# EasyEDA Pro project new0.2.epro, board PCB1_1
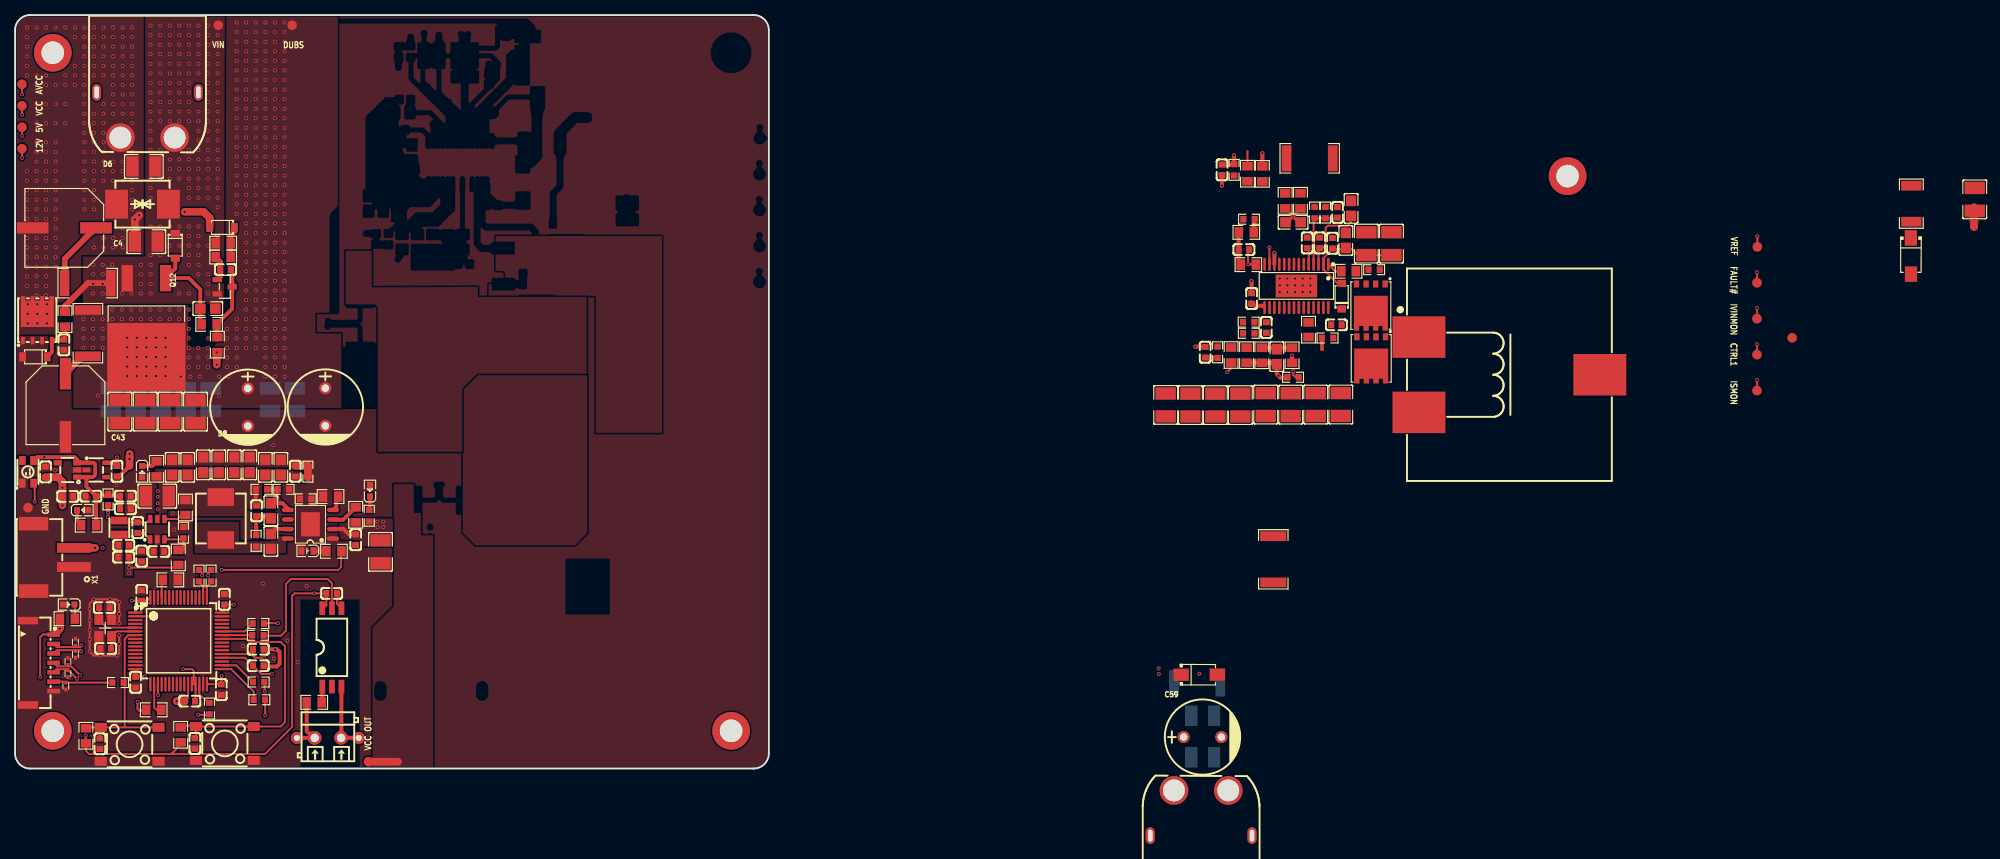
[diagram p1: board, top side]
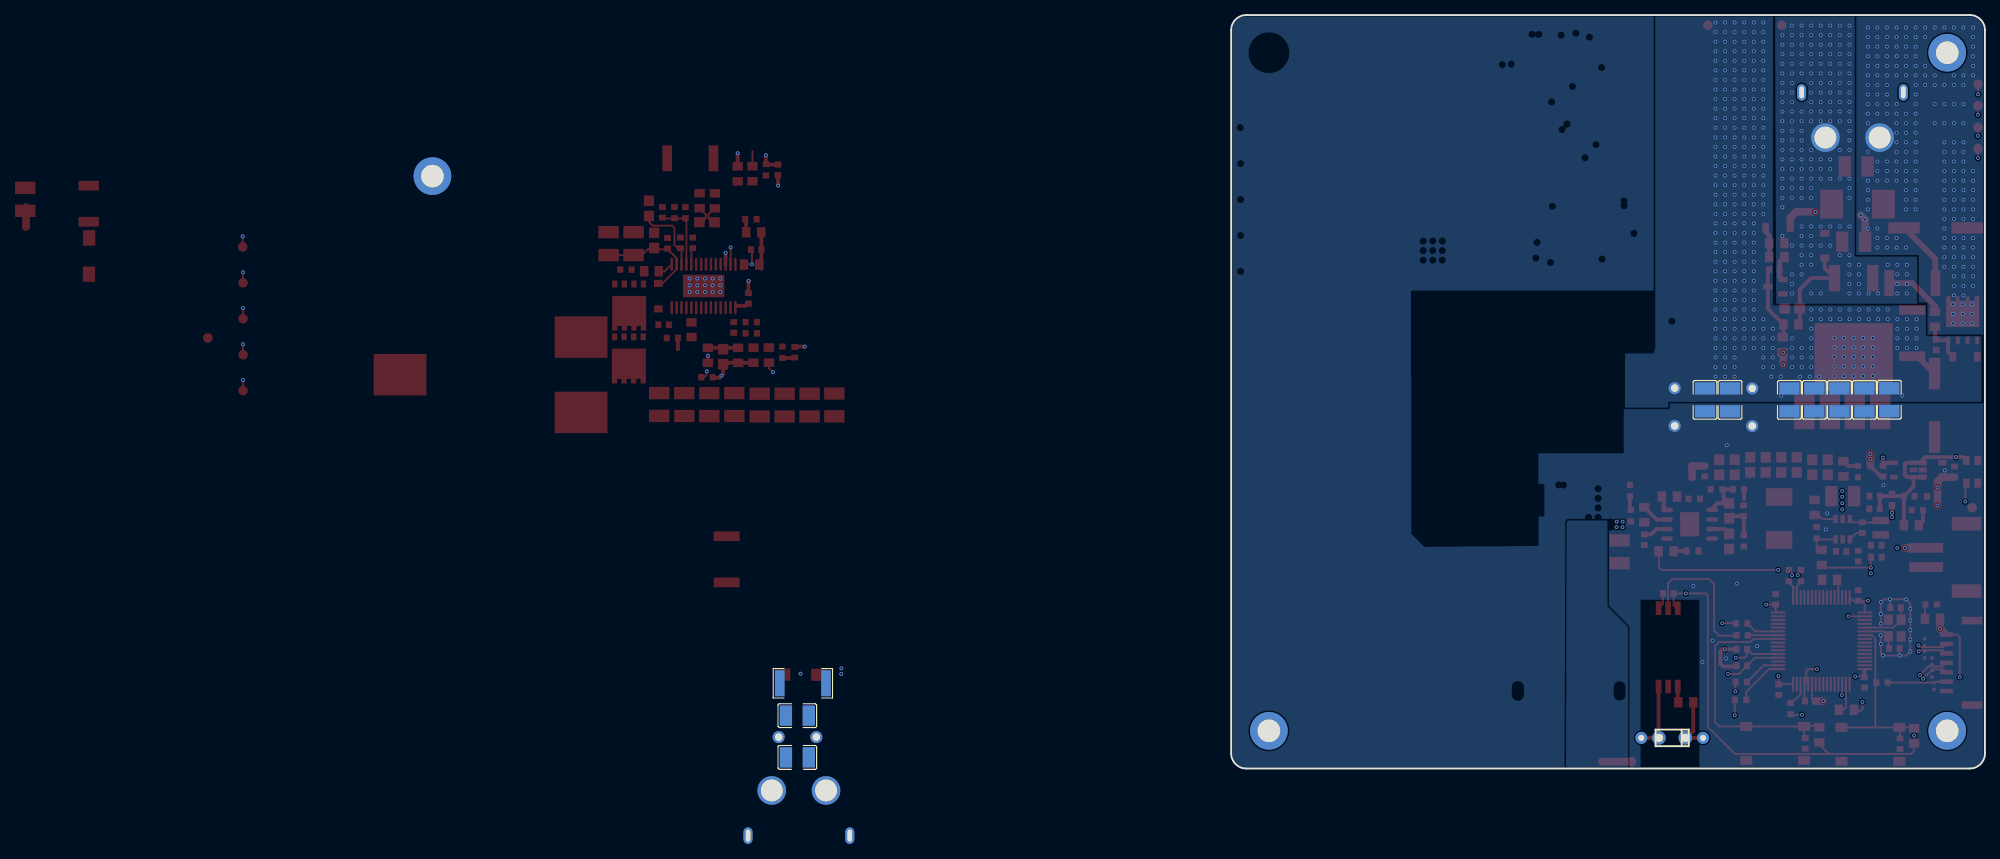
[diagram p2: board, bottom side, seen from below]

Outline 100 x 100 mm; copper layers: Top Layer, Inner1, Inner2, Inner3, Inner4, Bottom Layer. Coordinates in mm from the lower left corner of the outline.
Outline path: 0,98 0,2 arc(0.59,0.59) 2,0 98,0 arc(99.41,0.59) 100,2 100,98 arc(99.41,99.41) 98,100 2,100 arc(0.59,99.41) 0,98
Stack: Top Layer 0.035mm Outer layer thickness 1oz / Dielectric1 0.0994mm 3313 RC57% 4.2mil / Inner1 0.0152mm Inner layer thickness / Dielectric2 0.55mm 0.55mm H/H No copper / Inner2 0.0152mm Inner layer thickness / Dielectric3 0.1088mm 2116 RC54% 4.9mil / Inner3 0.0152mm Inner layer thickness / Dielectric4 0.55mm 0.55mm H/H No copper / Inner4 0.0152mm Inner layer thickness / Dielectric5 0.0994mm 3313 RC57% 4.2mil / Bottom Layer 0.035mm Outer layer thickness 1oz

## Design rules (mm)
net $1N984: DP6
net VCC_OUT: DP6
net $1N732: DP2
net $1N731: DP2
net $1N734: DP1
net $1N733: DP1
net $1N979: DP5
net $1N980: DP5
net DCBUS: DP7
net $1N947: DP7
net CLK: DP8
net DIO: DP8
spacing safeClearance (default): track to track 0.127, other pairs 0.127 to 0.127
spacing Copper_copperRegion: track to track 0.152, other pairs 0.152 to 0.152
spacing Plane_innerPlane: track to track 0.152, other pairs 0.152 to 0.152
track width trackWidth (default): min 0.127, default 0.254, max 2.54
differential pair differentialPair (default): width min 0.127, default 0.254, max 2.54; gap min 0.127, default 0.127
net GND uses copperRegion
net DCBUS uses copperRegion
net AGND uses copperRegion
net $1N947 uses copperRegion
net $1N990 uses copperRegion
net $1N984 uses copperRegion
net VCC_OUT uses copperRegion
net VCC_BAT uses copperRegion
net GND_BAT uses copperRegion
net 5V uses default
['net', '5v'] ['NET', '12V'] uses Copper_copperRegion

## Placement (name value [footprint] x y rotation side)
C1  1uF  [C0603]  10.05 36.15 180 top
C2  2.2uF  [C0603]  171.43 69.76 90 top
C3  10uF  [C1210]  17.08 79.91 0 top
C4  10uF  [C1210]  17.41 69.93 0 top
C5  100uF  [CAP-SMD_BD10.0-L10.3-W10.3-LS11.0-FD_1]  6.53 71.76 180 top
C6  100nF  [C0603]  6.47 56.23 90 top
C7  100nF  [C0603]  27.93 66.22 180 top
C8  1nF  [C0805]  25.57 61.04 0 top
C9  100uF  [CAP-SMD_BD10.0-L10.3-W10.3-LS11.0-FD_1]  6.68 48.21 270 top
C10  10uF  [C1210]  37.13 48.93 90 bottom
C11  10uF  [C1210]  33.82 48.93 90 bottom
C12  10uF  [C1210]  25.94 48.93 90 bottom
C13  10uF  [C1210]  22.63 48.93 90 bottom
C14  10uF  [C1210]  19.3 48.93 90 bottom
C15  10uF  [C1210]  15.99 48.93 90 bottom
C16  10uF  [C1210]  12.69 48.95 90 bottom
C17  220uF  [CAP-TH_BD10.0-P5.00-D0.6-FD_2]  30.88 47.95 270 top
C18  220uF  [CAP-TH_BD10.0-P5.00-D0.6-FD_2]  41.16 47.98 270 top
C19  10uF  [C1210]  20.58 47.37 90 top
C20  10uF  [C1210]  17.27 47.37 90 top
C21  2.2nF  [C0805]  33.94 30.14 90 top
C22  3.3nF  [C0603]  32.03 34.21 90 top
C23  10uF  [C1210]  48.48 28.76 270 top
C24  100nF  [C0603]  45.19 30.37 270 top
C25  2.2nF  [C0805]  33.94 34.21 90 top
C26  100nF  [C0603]  37.18 39.45 270 top
C27  10uF  [C0805]  20.84 39.98 90 top
C28  10uF  [C0805]  22.9 39.98 90 top
C29  10uF  [C1210]  18.87 36.15 180 top
C30  1uF  [C0603]  14.64 36.15 0 top
C31  1uF  [C0603]  6.99 36.12 0 top
C32  100nF  [C0603]  16.8 22.97 90 top
C33  100nF  [C0603]  27.77 22.46 90 top
C34  22pF  [C0603]  11.86 21.35 0 top
C35  22pF  [C0603]  12.01 15.94 180 top
C36  10uF  [C1210]  23.94 47.37 90 top
C37  10uF  [C0805]  24.96 40.3 270 top
C38  10uF  [C0805]  29.08 40.3 90 top
C39  10uF  [C0805]  27.02 40.3 270 top
C40  100nF  [C0603]  16.27 31.97 90 top
C41  100nF  [C0603]  163.03 68.88 0 top
C42  10nF  [C0603]  157.9 55.25 90 top
C43  10uF  [C1210]  13.9 47.37 90 top
C44  10uF  [C0603]  14.41 29.63 180 top
C45  100nF  [C0603]  14.4 28.05 180 top
C46  100nF  [C0603]  16.8 28.19 270 top
C47  4.7uF  [C0805]  177.26 74.34 270 top
C48  4.7uF  [C0603]  13.51 39.45 270 top
C49  33nF  [C0603]  166.01 58.54 270 top
C50  100nF  [C0603]  23.18 8.94 180 top
C51  100nF  [C0603]  11.25 3.28 270 top
C52  100nF  [C0603]  175.46 73.81 270 top
C53  1uF  [C0805]  176.56 70.09 270 top
C54  100nF  [C0603]  160.13 79.46 90 top
C55  100nF  [C0603]  4.04 39.37 90 top
C56  100nF  [C0603]  15.99 11.44 270 top
C57  100nF  [C0603]  27.36 10.47 270 top
C58  100nF  [C0603]  32.26 13.64 180 top
C59  470uF  [CAP-TH_BD10.0-P5.00-D0.6-FD-A]  157.54 4.17 0 top
C60  1nF  [C0805]  167.4 54.66 90 top
C61  100nF  [C0603]  23.85 3.33 270 top
C62  100nF  [C0603]  42 23.24 0 top
C63  10uF  [C1210]  157.56 1.48 180 bottom
C64  10uF  [C1210]  157.57 7.02 180 bottom
C65  100nF  [C0603]  14.64 34.47 0 top
C66  10uF  [C0805]  31.14 40.3 90 top
C67  10uF  [C0805]  33.2 39.98 90 top
C68  10uF  [C0805]  35.26 39.98 90 top
C69  1uF  [C1210]  260 75.54 270 top
C70  100nF  [C0603]  174.78 69.71 270 top
C71  100nF  [C0603]  173.08 69.76 270 top
C72  330nF  [C0603]  164.06 62.39 270 top
C73  1uF  [C1210]  165.93 48.3 90 top
C74  1uF  [C1210]  169.24 48.3 90 top
C75  47uF  [C1210]  179.28 69.66 90 top
C76  220nF  [C0603]  175.31 58.89 180 top
C77  1uF  [C0805]  169.56 72.5 0 top
C78  100nF  [C0603]  32.26 15.83 180 top
C79  1uF  [C1210]  172.56 48.31 90 top
C80  10uF  [C1210]  159.24 48.23 90 top
C81  10uF  [C1210]  155.94 48.23 90 top
C82  10uF  [C1210]  162.56 48.23 90 top
C83  10uF  [C1210]  152.65 48.26 90 top
C84  1uF  [C1210]  175.89 48.31 90 top
C85  47uF  [C1210]  182.61 69.66 90 top
C106  100nF  [C0603]  19.07 28.81 0 top
CN1  XT60PW-M  [CONN-TH_XT60PW-M]  157.36 -5.91 90 top
CN2  XT60PW-M  [CONN-TH_XT60PW-M]  17.57 86.74 270 top
CN3  5012  [TESTPOINT-TH_BD2.0_C9900010656]  26.96 98.65 0 top
CN4  5012  [TESTPOINT-TH_BD2.0_C9900010656]  0.92 90.82 0 top
CN5  5012  [TESTPOINT-TH_BD2.0_C9900010656]  0.92 87.97 0 top
CN6  5012  [TESTPOINT-TH_BD2.0_C9900010656]  1.71 34.61 0 top
CN7  5012  [TESTPOINT-TH_BD2.0_C9900010656]  0.92 85.12 0 top
CN8  5012  [TESTPOINT-TH_BD2.0_C9900010656]  36.76 98.65 0 top
CN9  WAFER-GH1.25-7PWB  [CONN-SMD_7P-P1.25_FWF12514-S07B24W5M]  3.41 14.03 270 top
CN10  2.54-2A-LT  [CONN-SMD_2P-P2.54_XH2.54-2AB]  5.13 28.02 90 top
CN11  5012  [TESTPOINT-TH_BD2.0_C9900010656]  0.92 82.27 0 top
CN12  5012  [TESTPOINT-TH_BD2.0_C9900010656]  231.1 50.16 90 top
CN13  5012  [TESTPOINT-TH_BD2.0_C9900010656]  231.1 54.92 0 top
CN14  5012  [TESTPOINT-TH_BD2.0_C9900010656]  46.89 0.91 0 top
CN15  5012  [TESTPOINT-TH_BD2.0_C9900010656]  235.78 57.16 180 top
CN16  5012  [TESTPOINT-TH_BD2.0_C9900010656]  231.15 69.23 0 top
CN17  5012  [TESTPOINT-TH_BD2.0_C9900010656]  231.1 59.7 0 top
CN18  5012  [TESTPOINT-TH_BD2.0_C9900010656]  231.1 64.47 0 top
D1  ESD9B5.0ST5G  [SOD-923_L0.8-W0.6-LS1.0-BI]  8.01 15.14 90 top
D2  ESD9B5.0ST5G  [SOD-923_L0.8-W0.6-LS1.0-BI]  8.01 16.77 270 top
D3  ESD9B5.0ST5G  [SOD-923_L0.8-W0.6-LS1.0-BI]  7.01 14.22 270 top
D4  ESD9B5.0ST5G  [SOD-923_L0.8-W0.6-LS1.0-BI]  7.01 12.59 90 top
D5  SS510  [SMA_L4.3-W2.6-LS5.0-RD]  251.53 68.01 270 top
D6  SMCJ45CA  [SMC_L6.9-W5.9-LS7.9-BI]  16.91 74.91 0 top
D7  BZT52C12  [SOD-123_L2.7-W1.6-LS3.7-RD]  2.63 54.64 180 top
D8  BZT52C12  [SOD-123_L2.7-W1.6-LS3.7-RD]  21.25 69.39 270 top
D9  DSS110  [SOD-123_L2.8-W1.8-LS3.7-RD]  176.01 62.69 90 top
D10  SS56  [SMA_L4.3-W2.6-LS5.0-RD]  157.11 12.45 0 top
D11  ESD9B5.0ST5G  [SOD-923_L0.8-W0.6-LS1.0-BI]  6.73 10.95 90 top
D13  1N4148TR  [DO-35_BD2.0-L4.2-P8.20-D0.5-RD]  41.5 4.06 0 bottom
K1  TS-KG02S  [SW-SMD_4P-L6.0-W6.0-P4.50-LS8.5]  15.19 3.21 0 top
K2  TS-KG02S  [SW-SMD_4P-L6.0-W6.0-P4.50-LS8.5]  27.83 3.33 0 top
L1  NCD0603R1  [LED0603-RD_RED]  47.09 36.88 90 top
L2  68uH  [IND-SMD_L7.2-W6.6_GPSR07X0]  27.3 33.18 90 top
L3  NCD0603R1  [LED0603-RD_RED]  7.14 21.76 180 top
L4  NCD0603R1  [LED0603-RD_RED]  16.85 39.4 270 top
L5  NCD0603R1  [LED0603-RD_RED]  8.97 34.29 0 top
L6  6.8uH  [IND-SMD_3P-L28.0-W27.0]  198.26 52.26 270 top
L7  4.7uH  [IND-SMD_L2.5-W2.0_SWPA252012S]  13.82 31.97 270 top
L10  NCD0603G1  [LED0603-RD_1]  38.79 28.88 0 top
LED1  XL-3528RGBW-2812B  [LED-SMD_4P-L3.5-W2.8-BR-1]  1.7 39.37 270 top
NOREF  -  [Pad_e2194]  5 5 0 top
NOREF#2  -  [Pad_e376]  205.98 78.62 0 top
NOREF#3  -  [Pad_e2193]  95 5 0 top
NOREF#4  -  [Pad_e2195]  5 95 0 top
Q1  BSC070N10LS5ATMA1  [PG-TDSON-8_L5.9-W5.2-P1.27-LS6.2-BL-EP]  179.92 54.44 180 top
Q3  SQM120P06-07L_GE3  [PG-TDSON-8_L5.9-W5.2-P1.27-LS6.2-BL-EP]  179.88 61.44 180 top
Q4  BSC014N06NS  [POWERVDFN-8_L6.2-W5.2-P1.27-LS6.0-BL]  2.95 58.57 0 top
Q11  MMBT5401LT1G  [SOT-23-3_L2.9-W1.3-P1.90-LS2.4-BR]  27.82 63.94 180 top
Q12  SQM120P06-07L_GE3  [TO-263-2_L10.1-W9.1-P5.08-LS15.2-TL-1]  17.42 59.85 270 top
R1  2.5mΩ  [R2512]  166.93 27.76 90 top
R2  10kΩ  [R0805]  18.39 7.79 180 top
R3  22kΩ  [R0805]  163.51 78.94 90 top
R4  18.2kΩ  [R0603]  159.54 55.24 270 top
R5  12kΩ  [R0603]  174.13 57.14 180 top
R6  300mΩ  [R2512]  9.63 64.43 0 top
R7  100kΩ  [R0805]  6.62 59.64 90 top
R8  100kΩ  [R0805]  27.61 69.72 180 top
R9  1kΩ  [R0805]  27.61 67.89 0 top
R10  10kΩ  [R0805]  26.84 56.26 90 top
R11  1kΩ  [R0805]  25.75 58.95 0 top
R12  2.5mΩ  [R2512]  171.76 80.99 0 top
R13  453kΩ  [R0603]  31.98 30.22 270 top
R14  1kΩ  [R0805]  6.95 19.88 180 top
R15  100kΩ  [R0805]  45.19 33.67 270 top
R16  453kΩ  [R0603]  32.7 37.05 180 top
R17  300mΩ  [R2512]  9.66 57.78 90 top
R18  1kΩ  [R0805]  39.69 8.79 0 top
R19  8.2kΩ  [R0805]  163.63 66.88 180 top
R20  22kΩ  [R0603]  46.99 33.55 90 top
R21  10Ω  [R0805_NEW]  171.61 58.24 270 top
R22  221kΩ  [R0805]  163.38 54.86 90 top
R23  10Ω  [R0603]  163.68 57.76 180 top
R24  10Ω  [R0603]  163.67 59.25 180 top
R25  10kΩ  [R0805]  18.77 39.77 90 top
R26  1kΩ  [R0805]  9.75 32.3 180 top
R27  0Ω  [R0603]  12.34 35.71 90 top
R28  100kΩ  [R0805]  41.86 36.09 0 top
R29  49.9kΩ  [R0603]  35.62 37.05 180 top
R30  240kΩ  [R0603]  163.71 72.9 180 top
R31  10kΩ  [R0805]  9.4 4.34 90 top
R32  12kΩ  [R0603]  180.31 66.21 0 top
R33  0Ω  [R0603]  38.55 35.79 0 top
R34  0Ω  [R0603]  38.85 39.4 90 top
R35  22Ω  [R0603]  32.27 19.24 0 top
R36  62kΩ  [R0805]  21.66 28.01 90 top
R37  2.2kΩ  [R2512]  156.83 11.31 180 bottom
R38  10kΩ  [R0805]  22.6 34.64 270 top
R39  12kΩ  [R0603]  22.34 31.31 90 top
R40  1kΩ  [R0805]  169.43 54.84 90 top
R41  10kΩ  [R0805]  165.41 54.84 270 top
R42  10Ω  [R0805_NEW]  176.92 66 0 top
R44  22Ω  [R0603]  13.66 11.4 180 top
R45  1kΩ  [R0805]  42.31 28.83 180 top
R48  4.7Ω  [R2010]  251.58 74.96 270 top
R49  10kΩ  [R0805]  163.36 71.17 180 top
R50  22Ω  [R0603]  32.41 9.12 0 top
R52  120kΩ  [R0603]  172.41 73.79 90 top
R53  3.57kΩ  [R0603]  173.86 73.79 90 top
R54  22Ω  [R0603]  32.31 11.48 0 top
R55  220Ω  [R0603]  32.22 17.68 0 top
R56  HNTC0603-104F3950FB  [R0603]  169.55 51.93 180 top
R57  20kΩ  [R0603]  161.73 79.46 90 top
R59  1kΩ  [R0805]  170.54 75.36 90 top
R60  1kΩ  [R0805]  168.51 75.34 90 top
R61  10kΩ  [R0805]  20.61 25.04 180 top
R62  10kΩ  [R0805]  165.48 78.93 270 top
R63  10kΩ  [R0805]  161.33 54.88 90 top
R64  22Ω  [R0603]  25.78 7.95 270 top
R65  22Ω  [R0603]  24.4 25.6 90 top
R66  22Ω  [R0603]  26 25.6 90 top
R67  10kΩ  [R0805]  21.97 4.47 90 top
U1  LT3763EFE#PBF  [TSSOP-28_L9.7-W4.4-P0.65-LS6.4-BL-EP-1]  170 64.05 180 top
U2  STM32G431RBT6  [LQFP-64_L10.0-W10.0-P0.50-LS12.0-BL]  21.7 16.95 270 top
U3  XC6210B332MR  [TSOT-23-5_L2.9-W1.6-P0.95-LS2.8-BR]  6.96 39.63 0 top
U4  LP5907QMFX-3.3Q1  [SOT-23-5_L3.0-W1.7-P0.95-LS2.8-BR]  10.77 39.63 180 top
U5  JW5026  [SOT-23-6_L2.9-W1.6-P0.95-LS2.8-BR]  18.87 31.76 270 top
U6  LM5164DDAR  [SO-8_L4.9-W3.9-P1.27-LS6.0-BL-EP]  39.19 32.42 90 top
U7  BZT52C43  [SOD-123_L2.7-W1.6-LS3.7-RD]  27.45 71.81 180 top
U8  TLP2761(D4-TP4,E  [SOP-6_L7.5-W3.8-P1.27-LS11.1-BL]  42.03 16.08 0 top
U9  DB301V-3.5-2P-GN-S  [CONN-TH_DB301V-3.5-2P-GN]  41.5 4.07 0 top
X1  8MHz  [CRYSTAL-SMD_4P-L3.2-W2.5-BL]  11.96 18.64 270 top

## Footprints (pads in the part's own frame, mm; a bottom-side part is the same pattern mirrored in y, then rotated)
C0603
  rect 0.8x0.9 smd: 1(-0.7,0) 2(0.7,0)
C0805
  rect 1.41x1.35 smd: 1(-1,0) 2(1,0)
C1210
  rect 1.635x2.7 smd: 1(-1.518,0) 2(1.518,0)
CAP-SMD_BD10.0-L10.3-W10.3-LS11.0-FD_1
  rect 4.2x1.5 smd: 1(-4.2,0) 2(4.2,0)
CAP-TH_BD10.0-P5.00-D0.6-FD-A
  round 1.6 hole 1: 1(-2.5,0) 2(2.5,0)
CAP-TH_BD10.0-P5.00-D0.6-FD_2
  round 1.6 hole 1: 1(-2.5,0) 2(2.5,0)
CONN-SMD_2P-P2.54_XH2.54-2AB
  rect 1.3x4.5 smd: 1(-1.27,-2.675) 2(1.27,-2.675)
  rect 1.8x3.9 smd: 3(-4.47,2.675) 4(4.47,2.675)
CONN-SMD_7P-P1.25_FWF12514-S07B24W5M
  rect 0.6x1.7 smd: 1(-3.75,1.7) 2(-2.5,1.7) 3(-1.25,1.7) 4(0,1.7) 5(1.25,1.7) 6(2.5,1.7) 7(3.75,1.7)
  rect 1x2.7 smd: 8(-5.6,-1.7) 9(5.6,-1.7)
CONN-TH_DB301V-3.5-2P-GN
  round 1.8 hole 1.1: 1(-1.75,0) 2(1.75,0)
CONN-TH_XT60PW-M
  round 3.8 hole 2.9: 1(3,-3.6) 2(3,3.6)
  oval 2.2x1.2 hole 1.6x0.6: 3(-3,6.75) 4(-3,-6.75)
CRYSTAL-SMD_4P-L3.2-W2.5-BL
  rect 1.4x1.2 smd: 1(-1.1,-0.85) 2(1.1,-0.85) 3(1.1,0.85) 4(-1.1,0.85)
DO-35_BD2.0-L4.2-P8.20-D0.5-RD
  round 1.6 hole 0.8: 1(-4.1,0) 2(4.1,0)
IND-SMD_3P-L28.0-W27.0
  rect 5.5x7 smd: 1(-5,-12) 2(5,-12) 3(0,12)
IND-SMD_L2.5-W2.0_SWPA252012S
  rect 1x2.2 smd: 1(-0.951,0) 2(0.951,0)
IND-SMD_L7.2-W6.6_GPSR07X0
  rect 2.35x3.5 smd: 1(-2.85,0) 2(2.85,0)
LED0603-RD_1
  rect 0.8x1 smd: 1(0.799,-0.004) 2(-0.799,0.004)
LED0603-RD_RED
  rect 0.8x0.8 smd: 1(-0.749,-0.004) 2(0.749,0.004)
LED-SMD_4P-L3.5-W2.8-BR-1
  rect 1.2x0.9 smd: 1(1.5,-0.75) 2(1.5,0.75) 3(-1.5,0.75) 4(-1.5,-0.75)
LQFP-64_L10.0-W10.0-P0.50-LS12.0-BL
  oval 0.3x2 smd: 1(-3.75,-5.75) 2(-3.25,-5.75) 3(-2.75,-5.75) 4(-2.25,-5.75) 5(-1.75,-5.75) 6(-1.25,-5.75) 7(-0.75,-5.75) 8(-0.25,-5.75) 9(0.25,-5.75) 10(0.75,-5.75) 11(1.25,-5.75) 12(1.75,-5.75) 13(2.25,-5.75) 14(2.75,-5.75) 15(3.25,-5.75) 16(3.75,-5.75) 33(3.75,5.75) 34(3.25,5.75) 35(2.75,5.75) 36(2.25,5.75) 37(1.75,5.75) 38(1.25,5.75) 39(0.75,5.75) 40(0.25,5.75) 41(-0.25,5.75) 42(-0.75,5.75) 43(-1.25,5.75) 44(-1.75,5.75) 45(-2.25,5.75) 46(-2.75,5.75) 47(-3.25,5.75) 48(-3.75,5.75)
  oval 2x0.3 smd: 17(5.75,-3.75) 18(5.75,-3.25) 19(5.75,-2.75) 20(5.75,-2.25) 21(5.75,-1.75) 22(5.75,-1.25) 23(5.75,-0.75) 24(5.75,-0.25) 25(5.75,0.25) 26(5.75,0.75) 27(5.75,1.25) 28(5.75,1.75) 29(5.75,2.25) 30(5.75,2.75) 31(5.75,3.25) 32(5.75,3.75) 49(-5.75,3.75) 50(-5.75,3.25) 51(-5.75,2.75) 52(-5.75,2.25) 53(-5.75,1.75) 54(-5.75,1.25) 55(-5.75,0.75) 56(-5.75,0.25) 57(-5.75,-0.25) 58(-5.75,-0.75) 59(-5.75,-1.25) 60(-5.75,-1.75) 61(-5.75,-2.25) 62(-5.75,-2.75) 63(-5.75,-3.25) 64(-5.75,-3.75)
Pad_e376
  round 5 hole 3: 1(0,0)
Pad_e2193
  round 5 hole 3: 1(0,0)
Pad_e2194
  round 5 hole 3: 1(0,0)
Pad_e2195
  round 5 hole 3: 1(0,0)
PG-TDSON-8_L5.9-W5.2-P1.27-LS6.2-BL-EP
  rect 0.7x0.925 smd: 1(-1.905,-2.865) 2(-0.635,-2.865) 3(0.635,-2.865) 4(1.905,-2.865) 5(1.905,2.865) 6(0.635,2.865) 7(-0.635,2.865) 8(-1.905,2.865)
  rect 4.5x4 smd: 9(0.001,0.705)
POWERVDFN-8_L6.2-W5.2-P1.27-LS6.0-BL
  rect 0.5x1 smd: 1(-1.905,-1.775) 2(-0.635,-1.775) 3(0.635,-1.775) 4(1.905,-1.775)
  custom 4.4x4.1 smd: 5(0,1.775)
R0603
  rect 0.806x0.864 smd: 1(-0.753,0) 2(0.753,0)
R0805
  rect 1.133x1.377 smd: 1(-1,0) 2(1,0)
R0805_NEW
  rect 1.133x1.377 smd: 1(-0.966,0) 2(0.966,0)
R2010
  rect 1.282x2.7 smd: 1(-2.391,0) 2(2.391,0)
R2512
  rect 1.282x3.456 smd: 1(-3.067,0) 2(3.067,0)
SMA_L4.3-W2.6-LS5.0-RD
  rect 2.046x1.62 smd: 1(-2.404,-0.009) 2(2.404,0.009)
SMC_L6.9-W5.9-LS7.9-BI
  rect 3.03x3.82 smd: 1(-3.435,0) 2(3.435,0)
SO-8_L4.9-W3.9-P1.27-LS6.0-BL-EP
  oval 0.6x1.6 smd: 1(-1.905,-3) 2(-0.635,-3) 3(0.635,-3) 4(1.905,-3) 5(1.905,3) 6(0.635,3) 7(-0.635,3) 8(-1.905,3)
  rect 3.2x2.5 smd: 9(0,0)
SOD-123_L2.7-W1.6-LS3.7-RD
  rect 0.91x1.22 smd: 1(-1.635,0) 2(1.635,0)
SOD-123_L2.8-W1.8-LS3.7-RD
  rect 0.95x1.15 smd: 1(-1.692,0) 2(1.692,0)
SOD-923_L0.8-W0.6-LS1.0-BI
  rect 0.5x0.4 smd: 1(-0.457,0) 2(0.457,0)
SOP-6_L7.5-W3.8-P1.27-LS11.1-BL
  rect 0.76x1.8 smd: 1(-1.27,-5.2) 2(0,-5.2) 3(1.27,-5.2) 4(1.27,5.2) 5(0,5.2) 6(-1.27,5.2)
SOT-23-3_L2.9-W1.3-P1.90-LS2.4-BR
  rect 1.25x0.7 smd: 1(1,-0.95) 2(1,0.95) 3(-1,0)
SOT-23-5_L3.0-W1.7-P0.95-LS2.8-BR
  rect 1x0.6 smd: 1(1.3,-0.95) 2(1.3,0) 3(1.3,0.95) 4(-1.3,0.95) 5(-1.3,-0.95)
SOT-23-6_L2.9-W1.6-P0.95-LS2.8-BR
  rect 1.1x0.6 smd: 1(1.35,-0.95) 2(1.35,0) 3(1.35,0.95) 4(-1.35,0.95) 5(-1.35,0) 6(-1.35,-0.95)
SW-SMD_4P-L6.0-W6.0-P4.50-LS8.5
  rect 1.6x1.2 smd: 1(-3.835,-2.25) 1(3.835,-2.25) 2(-3.835,2.25) 2(3.835,2.25)
TESTPOINT-TH_BD2.0_C9900010656
  round 1.27 smd: 1(0,0)
TO-263-2_L10.1-W9.1-P5.08-LS15.2-TL-1
  rect 3.5x1.5 smd: 1(-5.228,2.54) 3(-5.228,-2.54)
  rect 9x10.4 smd: 4(5.228,0)
TSOT-23-5_L2.9-W1.6-P0.95-LS2.8-BR
  rect 1.1x0.7 smd: 1(1.294,-0.951) 2(1.294,-0.001) 3(1.294,0.951) 4(-1.294,0.951) 5(-1.294,-0.949)
TSSOP-28_L9.7-W4.4-P0.65-LS6.4-BL-EP-1
  oval 0.343x1.746 smd: 1(-4.225,-2.873) 2(-3.575,-2.873) 3(-2.925,-2.873) 4(-2.275,-2.873) 5(-1.625,-2.873) 6(-0.975,-2.873) 7(-0.325,-2.873) 8(0.325,-2.873) 9(0.975,-2.873) 10(1.625,-2.873) 11(2.275,-2.873) 12(2.925,-2.873) 13(3.575,-2.873) 14(4.225,-2.873) 15(4.225,2.873) 16(3.575,2.873) 17(2.925,2.873) 18(2.275,2.873) 19(1.625,2.873) 20(0.975,2.873) 21(0.325,2.873) 22(-0.325,2.873) 23(-0.975,2.873) 24(-1.625,2.873) 25(-2.275,2.873) 26(-2.925,2.873) 27(-3.575,2.873) 28(-4.225,2.873)
  rect 5.5x3 smd: 29(0,0)

## Nets
5V: C1.1 C30.1 C65.1 CN7.1 LED1.3 R26.1 R27.2 U3.1 U3.3 U4.1 U4.3
12V: C22.2 C26.2 C27.1 C28.1 C29.1 C37.2 C38.1 C39.2 C66.1 C67.1 C68.1 CN10.2 CN11.1 L2.2 R16.2 R25.1 R38.1 U5.5
AGND: C2.2 C41.1 C42.2 C48.2 C50.2 C54.1 C58.1 C60.1 C72.1 C78.1 R19.2 R22.1 R41.2 R49.2 R56.2 U1.12 U2.27
AVCC: C48.1 C50.1 CN4.1 U2.28 U2.29 U4.5
GND: C1.2 C6.1 C9.2 C10.1 C11.1 C12.1 C13.1 C14.1 C15.1 C16.1 C17.2 C18.2 C19.1 C20.1 C23.2 C24.2 C26.1 C27.2 C28.2 C29.2 C30.2 C31.2 C32.2 C33.2 C34.2 C35.2 C36.1 C37.1 C38.2 C39.1 C43.1 C44.2 C45.2 C46.2 C47.1 C51.2 C52.1 C53.1 C55.2 C56.2 C57.2 C59.2 C61.2 C62.2 C63.1 C64.1 C65.2 C66.2 C67.2 C68.2 C69.1 C70.1 C71.1 C73.1 C74.1 C75.2 C79.1 C80.1 C81.1 C82.1 C83.1 C84.1 C85.2 C106.2 CN1.1 CN6.1 CN9.7 CN9.8 CN9.9 CN10.1 CN10.3 CN10.4 D1.1 D2.1 D3.1 D4.1 D5.2 D7.2 D10.2 D11.1 K1.1 K2.1 L1.2 L3.2 L4.2 L5.2 L10.2 LED1.1 Q3.1 Q3.2 Q3.3 Q4.1 Q4.2 Q4.3 R10.1 R28.1 R29.1 R32.2 R33.1 R33.2 R34.1 R34.2 R37.1 R39.2 R53.2 R61.1 U1.21 U1.23 U1.28 U1.29 U2.15 U2.31 U2.47 U2.63 U3.2 U4.2 U5.2 U6.1 U6.9 U8.4 X1.2 X1.4
GND_BAT: C3.1 C4.1 C5.2 CN2.1 D6.1 Q4.5 U7.2
VCC: C31.1 C32.1 C33.1 C55.1 C56.1 C57.1 C62.1 CN5.1 CN9.1 R3.2 R14.2 R31.1 R67.1 U2.1 U2.16 U2.32 U2.48 U2.64 U3.5 U8.6
VCC_BAT: C3.2 C4.2 C8.2 CN2.2 CN3.1 D6.2 D8.1 Q11.2 Q12.3 R6.2 R7.2 R8.2
VCC_OUT: C59.1 C63.2 C64.2 CN1.2 CN14.1 D10.1 R1.2 R24.2 R30.2 R37.2
CLK: R65.1 U2.50
DCBUS: C10.2 C11.2 C12.2 C13.2 C14.2 C15.2 C16.2 C17.1 C18.1 C19.2 C20.2 C23.1 C24.1 C36.2 C43.2 CN8.1 Q12.4 R12.1 R15.2 R17.2 R20.1 R52.2 R60.2 U6.2
DIANLIUKONGZHI: C41.2 CN13.1 R2.2 R19.1 U1.14
DIO: R66.1 U2.49
FB: C25.2 R16.1 R29.2 U6.5
KEY1: C61.1 K2.2 R67.2 U2.41
NRST: C51.1 K1.2 R31.2 R44.1 U2.7
O_IN: C34.1 U2.5 X1.1
O_OUT: C35.1 U2.6 X1.3
PA: D13.1 R18.1 U9.1
PWM: R35.2 R40.1
R_EN: R45.1 U2.2
RGB: LED1.2 U2.19
RX_TX: R50.1 U2.33
SHOOT: R55.2 U8.5
SHUCHUDIANLIUJIANCE: C58.2 R63.1 U2.36
SHURUDIANLIUJIANCE: C78.2 R62.1 U2.37
STOP: CN18.1 R3.1 R54.2 U1.9
TX_RX: R64.1 U2.30
WGND: D13.2 U8.3 U9.2
$1N490: C7.1 Q11.3 R10.2 R11.2
$1N491: C8.1 D8.2 Q12.1 R11.1
$1N492: C7.2 Q11.1 R9.1
$1N493: R8.1 R9.2 U7.1
$1N496: C6.2 D7.1 Q4.4 R7.1
$1N497: C5.1 R6.1
$1N498: C9.1 R17.1
$1N520: L1.1 R20.2
$1N560: C21.2 U6.7
$1N561: R15.1 U6.3
$1N562: C21.1 L2.1 R13.2 U6.8
$1N567: R28.2 U6.4
$1N570: L4.1 R25.2
$1N628: L3.1 R14.1
$1N635: C40.1 U5.1
$1N636: C40.2 L7.1 U5.6
$1N647: L5.1 R26.2
$1N701: L10.1 R45.2
$1N731: CN9.5 D4.2 R50.2
$1N732: CN9.4 D3.2 R64.2
$1N733: CN9.3 D1.2 R65.2
$1N734: CN9.2 D2.2 R66.2
$1N758: R35.1 U2.43
$1N824: R55.1 U2.42
$1N834: R36.2 R39.1 U5.3
$1N836: C44.1 C45.1 C46.1 C106.1 L7.2 R27.1 R36.1
$1N839: R38.2 U5.4
$1N846: C22.1 C25.1 R13.1
$1N868: CN9.6 D11.2 R44.2
$1N887: R61.2 U2.61
$1N947: C47.2 C71.2 C73.2 C74.2 C79.2 C80.2 C81.2 C82.2 C83.2 C84.2 Q1.5 Q1.6 Q1.7 Q1.8 Q1.9 R12.2 R59.2 U1.3
$1N960: CN17.1 R62.2 U1.8
$1N961: CN12.1 R63.2 U1.19
$1N963: C53.2 C70.2 C75.1 C85.1 CN15.1 D9.2 U1.2
$1N964: C76.1 D9.1 U1.27
$1N965: C54.2 R56.1 R57.2 U1.13
$1N967: C2.1 CN16.1 R57.1 U1.5 U1.10
$1N969: C72.2 U1.15
$1N970: C52.2 R52.1 R53.1 U1.4
$1N971: R4.1 U1.18
$1N973: C42.1 R4.2
$1N978: R30.1 R49.1 U1.11
$1N979: C49.2 R23.1 U1.17
$1N980: C49.1 R24.1 U1.16
$1N981: R22.2 U1.20
$1N983: C77.2 R59.1 U1.6
$1N984: L6.2 R1.1 R23.2
$1N986: C77.1 R60.1 U1.7
$1N987: Q3.4 R32.1 R42.2
$1N988: R42.1 U1.1
$1N989: C69.2 R48.1
$1N990: C76.2 D5.1 L6.1 Q1.1 Q1.2 Q1.3 Q3.5 Q3.6 Q3.7 Q3.8 Q3.9 R5.1 R48.2 U1.26
$1N991: Q1.4 R5.2 R21.2
$1N992: R21.1 U1.25
$1N1002: C60.2 R40.2 R41.1 U1.22
$1N1004: R54.1 U2.34
$1N1013: R2.1 U2.18
$1N1014: R18.2 U8.1

Pads without a net: CN1 3 4; CN2 3 4; L6 3; LED1 4; NOREF 1; NOREF#2 1; NOREF#3 1; NOREF#4 1; U1 24; U2 3 4 8 9 10 11 12 13 14 17 20 21 22 23 24 25 26 35 38 39 40 44 45 46 51 52 53 54 55 56 57 58 59 60 62; U3 4; U4 4; U6 6; U8 2

## Via types
v1: diameter 0.508, hole 0.305, Top Layer to Bottom Layer, 782 vias

## Routing (per net, layer and track width the routed paths; a pad name or vN(x,y) marks a point on that pad's centre or on a via; arc(x,y) is an arc through that point)
5V: length 77.1
  Top Layer w0.254: 0.92,85.11 0.92,83.96
  Top Layer w0.508: C65.1 C30.1 C1.1 ; LED1.3 2.91,41.33 v1(3.87,41.33) 7.92,41.33 8.25,40.99 U3.3 U4.1 10.43,40.58 10.63,40.37 10.63,38.99 10.33,38.68 U4.3 9.47,37.43 C1.1 ; R26.1 10.75,36.14 C1.1 ; U3.1 9.47,38.68
  Inner4 w0.254: v1(0.92,83.96) 6.62,83.96 6.88,83.7 6.88,41.58 6.62,41.33 3.85,41.33
12V: length 88.4
  Top Layer w0.254: v1(0.92,81.03) 0.92,81.03 CN11.1
  Top Layer w0.508: 31.94,35.74 R16.2
  Top Layer w1.016: CN10.2 v1(10.6,29.29)
  Inner2 w1.016: 18.89,36.8 18.89,30.56 17.62,29.29 v1(11.62,29.29) 10.6,29.29 v1(10.6,29.29)
  Inner4 w0.254: v1(18.92,36.83) 18.85,36.75 3.59,36.75 3.34,37.01 3.34,41.85 3.65,42.16 6.21,42.16 6.47,42.42 6.47,80.82 6.19,81.1 1,81.1 v1(0.92,81.03)
  vias: v1(18.92,36.07) v1(18.92,35.21) v1(18.92,34.39)
AGND: length 138.1
  Top Layer w0.254: U2.27 22.95,9.41 C50.2
  Top Layer w0.508: C54.1 160.12,78.75 160.12,77.36 ; C42.2 157.86,55.99 v1(156.57,55.99) ; 164.06,63.08 164.06,64.67 v1(164.02,64.7) ; 168.8,51.93 168.73,51.85 167.91,51.85 v1(167.63,52.13) 167.4,52.36 C60.1 167.21,53.86 R22.1 ; U1.12 v1(167.08,68.44) ; C48.2 13.79,38.75 15.19,40.15 ; 162.33,66.32 C41.1 162.33,71.14 R49.2 ; 33.07,13.53 34.74,13.53 35.09,13.89 35.09,15.47 34.74,15.82 v1(34.51,15.82) 34.51,15.83 C78.1
  Top Layer w1.016: v1(15.21,41.76) 15.21,41.35 15.19,41.33 v1(15.19,41.07) 15.19,40.15 ; C50.2 v1(21.43,8.94)
  Inner2 w0.508: 31.74,15.82 v1(34.51,15.82)
  Inner2 w1.524: 15.21,41.58 40.83,41.58 43.03,43.78 43.03,78.43 ; 31.74,41.45 31.74,15.82 31.91,15.66 31.91,12.79 29.35,10.24 22.72,10.24 v1(21.43,8.94)
  vias: v1(160.11,77.36)
AVCC: length 106.2
  Top Layer w0.254: U2.28 23.71,11.2 ; 23.71,11.2 U2.29 23.95,9.01 C50.1 ; 23.71,11.2 23.71,12.96 23.49,13.18 v1(22.28,13.18) ; CN4.1 v1(0.92,89.48)
  Top Layer w0.508: U4.5 13.09,40.58 C48.1 13.53,40.17 v1(13.53,41.27)
  Inner4 w0.254: v1(22.28,13.18) 22.22,13.18 21.78,13.61 21.78,38.99 20.69,40.08 13.81,40.08 13.53,40.36 v1(13.53,41.27) 8.37,41.27 7.64,42.01 7.64,89.23 7.38,89.48 v1(0.92,89.48)
GND: length 29.3
  Top Layer w0.254: 42.7,23.24 42.7,21.87 U8.4 ; v1(11.33,14.99) 10.43,14.99 v1(9.9,15.52) v1(9.9,17.11) v1(9.9,18.38) v1(9.9,19.65) v1(9.9,21.21) 9.9,21.9 v1(10.44,22.44) 10.47,22.47 v1(12.6,22.47) 12.6,22.44 ; v1(11.33,14.99) 11.33,15.93 C35.2 ; v1(11.33,14.99) v1(13.53,14.99) 13.81,15.26 v1(13.81,16.53) v1(13.81,17.68) ; C34.2 12.6,21.39 12.6,22.44 13.44,22.44 v1(13.81,22.07) v1(13.81,20.5) v1(13.81,19.23)
  Top Layer w1.016: C26.1 38.85,40.15 R34.2 R34.1 ; v1(26.76,55.22) v1(26.76,53.59)
  vias: v1(5.32,39.56) v1(13.45,37.62) v1(20.92,33.87) v1(21.12,31.72) v1(30.23,16.24) v1(32.88,24.54) v1(34.26,42.91) v1(34.33,14.6) v1(36.13,16.99) v1(37.48,14.14) v1(38.68,24.21) v1(167.79,65.03) v1(167.79,64.13) v1(167.79,63.22) v1(168.8,65.03) v1(168.8,64.13) v1(168.8,63.22) v1(169.82,65.03) v1(169.82,64.13) v1(169.82,63.22) v1(170.83,65.03) v1(170.83,64.13) v1(170.83,63.22) v1(171.85,65.03) v1(171.85,64.13) v1(171.85,63.22)
GND_BAT: length 15.5
  Top Layer w1.016: v1(22.49,73.89) 25.02,73.89 25.82,73.09 U7.2 ; v1(16.48,73.43) v1(15.9,72.85) C4.1
  Inner2 w1.016: 16.07,72.95 17.01,73.89 v1(22.49,73.89)
  vias: v1(1.58,98.34) v1(1.58,97.07) v1(1.58,95.8) v1(1.58,94.53) v1(1.58,93.26) v1(1.58,91.99) v1(1.58,79.29) v1(1.58,78.02) v1(1.58,76.75) v1(1.58,75.48) v1(1.58,74.21) v1(1.58,72.94) v1(1.58,70.4) v1(1.58,69.13) v1(1.58,67.86) v1(1.58,66.59) v1(1.58,65.32) v1(1.58,64.05) v1(1.68,61.62) v1(1.68,60.35) v1(1.68,59.08) v1(2.85,98.34) v1(2.85,91.99) v1(2.85,90.72) v1(2.85,88.18) v1(2.85,85.64) v1(2.85,83.1) v1(2.85,81.83) v1(2.85,80.56) v1(2.85,79.29) v1(2.85,78.02) v1(2.85,76.75) v1(2.85,75.48) v1(2.85,74.21) v1(2.85,72.94) v1(2.85,70.4) v1(2.85,69.13) v1(2.85,67.86) v1(2.85,66.59) v1(2.85,65.32) v1(2.85,64.05) v1(2.85,62.78) v1(2.95,61.62) v1(2.95,60.35) v1(2.95,59.08) v1(4.12,98.34) v1(4.12,91.99) v1(4.12,90.72) v1(4.12,88.18) v1(4.12,85.64) v1(4.12,83.1) v1(4.12,81.83) v1(4.12,80.56) v1(4.12,79.29) v1(4.12,78.02) v1(4.12,76.75) v1(4.12,75.48) v1(4.12,74.21) v1(4.12,72.94) v1(4.12,70.4) v1(4.12,69.13) v1(4.12,67.86) v1(4.12,66.59) v1(4.12,65.32) v1(4.12,64.05) v1(4.12,62.78) v1(4.22,61.62) v1(4.22,60.35) v1(4.22,59.08) v1(5.39,98.34) v1(5.39,90.72) v1(5.39,88.18) v1(5.39,85.64) v1(5.39,83.1) v1(5.39,81.83) v1(5.39,80.56) v1(5.39,79.29) v1(5.39,78.02) v1(5.39,76.75) v1(5.39,75.48) v1(5.39,74.21) v1(5.39,72.94) v1(5.39,71.67) v1(5.39,70.4) v1(5.39,69.13) v1(5.39,67.86) v1(5.39,66.59) v1(6.66,98.34) v1(6.66,91.99) v1(6.66,90.72) v1(6.66,88.18) v1(6.66,85.64) v1(7.93,98.34) v1(7.93,97.07) v1(7.93,93.26) v1(7.93,91.99) v1(7.93,90.72) v1(9.2,98.34) v1(9.2,97.07) v1(9.2,95.8) v1(9.2,94.53) v1(9.2,93.26) v1(9.2,91.99) v1(9.2,90.72) v1(9.2,89.45) v1(9.2,88.18) v1(9.2,86.91) v1(9.2,85.64) v1(9.2,84.37) v1(9.2,83.1) v1(9.2,81.83) v1(9.2,80.56) v1(9.2,79.29) v1(9.2,78.02) v1(9.2,76.75) v1(9.2,75.48) v1(9.2,74.21) v1(10.47,98.34) v1(10.47,97.07) v1(10.47,95.8) v1(10.47,94.53) v1(10.47,93.26) v1(10.47,91.99) v1(10.47,86.91) v1(10.47,85.64) v1(10.47,84.37) v1(10.47,83.1) v1(10.47,81.83) v1(10.47,80.56) v1(10.47,79.29) v1(10.47,78.02) v1(10.47,76.75) v1(10.47,75.48) v1(10.47,74.21) v1(10.47,69.13) v1(11.74,98.34) v1(11.74,97.07) v1(11.74,95.8) v1(11.74,94.53) v1(11.74,93.26) v1(11.74,91.99) v1(11.74,88.18) v1(11.74,86.91) v1(11.74,85.64) v1(11.74,84.37) v1(11.74,83.1) v1(11.74,81.83) v1(11.74,80.56) v1(11.74,79.29) v1(11.74,78.02) v1(11.74,70.4) v1(11.74,69.13) v1(13.01,98.34) v1(13.01,97.07) v1(13.01,95.8) v1(13.01,94.53) v1(13.01,93.26) v1(13.01,91.99) v1(13.01,90.72) v1(13.01,89.45) v1(13.01,88.18) v1(13.01,86.91) v1(13.01,80.56) v1(13.01,79.29) v1(13.01,78.02) v1(13.01,70.4) v1(13.01,69.13) v1(14.28,98.34) v1(14.28,97.07) v1(14.28,95.8) v1(14.28,94.53) v1(14.28,93.26) v1(14.28,91.99) v1(14.28,90.72) v1(14.28,89.45) v1(14.28,88.18) v1(14.28,86.91) v1(14.28,80.56) v1(14.28,79.29) v1(14.28,78.02) v1(14.28,71.67) v1(14.28,70.4) v1(14.28,69.13) v1(15.55,98.34) v1(15.55,97.07) v1(15.55,95.8) v1(15.55,94.53) v1(15.55,93.26) v1(15.55,91.99) v1(15.55,90.72) v1(15.55,89.45) v1(15.55,88.18) v1(15.55,86.91) v1(15.55,85.64) v1(15.55,81.83) v1(15.55,78.02) v1(15.55,76.75) v1(15.55,75.48) v1(15.55,74.21) v1(15.55,71.67)
VCC: length 318.3
  Top Layer w0.254: v1(27.4,12.27) 27.36,12.23 C57.1 27.32,11.2 U2.32 ; 16.44,22.27 15.49,22.27 v1(15.49,22.28) ; 16.44,22.27 C32.1 17.52,22.27 U2.64 ; 16.44,22.27 15.95,21.77 U2.1 ; 20.83,2.03 20.72,1.93 9.8,1.93 9.43,2.3 9.43,3.32 R31.1 9.38,3.36 v1(9.38,4.36) ; 20.83,2.03 20.83,1.93 33.17,1.93 36.76,5.52 36.76,22.92 37.08,23.24 v1(39.69,23.24) C62.1 41.3,21.68 40.9,21.28 U8.6 ; 20.83,2.03 21.97,3.18 R67.1 ; v1(29.02,21.76) C33.1 27.77,21.02 U2.48 ; 163.52,81.91 163.51,81.9 R3.2 ; CN5.1 v1(0.92,86.77) ; CN9.1 5.1,17.79 3.71,17.79 3.33,17.41 v1(3.33,12.11) ; C56.1 16.06,12.22 v1(17.21,12.22)
  Top Layer w0.508: C56.1 15.99,13.06
  Top Layer w1.016: v1(6.29,34.91) v1(6.29,37.28) 6.29,38.06 U3.5 5.66,38.67 C55.1 ; R14.2 v1(5.95,18.57) 5.34,17.96
  Inner2 w0.254: v1(6.29,37.28) 6.29,37.28 6.29,42.47 7.39,43.56 37.23,43.56 38.12,44.45 38.12,94.72 ; v1(17.21,12.22) 17.23,12.2 27.33,12.2 v1(27.4,12.27) 29.02,13.89 v1(29.02,21.76) ; v1(9.38,4.36) 9.38,8.81 8.38,9.81 3.51,9.81 3.33,9.99 v1(3.33,12.11)
  Inner2 w0.355: v1(15.49,22.28) 16.76,23.54 16.76,27.13 17.11,27.48 28.67,27.48 29.02,27.13 v1(29.02,21.76)
  Inner2 w1.016: v1(6.29,34.91) 6.29,32.66 4.89,31.27 4.89,22.63 ; v1(15.49,22.28) 13.25,24.51 6.77,24.51 4.89,22.63 ; 4.89,22.63 4.89,19.62 v1(5.95,18.57)
  Inner4 w0.254: v1(0.92,86.77) 6.75,86.77 7.26,86.26 7.26,38.24 v1(6.29,37.28)
VCC_BAT: length 8.1
  Top Layer w0.762: R6.2 9.65,64.43 6.62,61.4 6.62,60.66
  vias: v1(10.36,66.86) v1(10.36,65.59) v1(10.36,64.32) v1(10.36,63.05) v1(11.63,66.86) v1(11.63,65.59) v1(11.63,64.32) v1(11.63,63.05) v1(12.9,66.86) v1(14.17,63.05) v1(15.44,63.05) v1(16.71,66.86) v1(16.71,65.59) v1(16.71,64.32) v1(16.71,63.05) v1(17.98,98.61) v1(17.98,97.34) v1(17.98,96.07) v1(17.98,94.8) v1(17.98,93.53) v1(17.98,92.26) v1(17.98,90.99) v1(17.98,89.72) v1(17.98,88.45) v1(17.98,87.18) v1(17.98,85.91) v1(17.98,84.64) v1(17.98,83.37) v1(17.98,82.1) v1(17.98,78.29) v1(17.98,77.02) v1(17.98,75.75) v1(17.98,71.94) v1(17.98,68.13) v1(17.98,66.86) v1(17.98,65.59) v1(17.98,64.32) v1(17.98,63.05) v1(19.25,98.61) v1(19.25,97.34) v1(19.25,96.07) v1(19.25,94.8) v1(19.25,93.53) v1(19.25,92.26) v1(19.25,90.99) v1(19.25,89.72) v1(19.25,88.45) v1(19.25,87.18) v1(19.25,85.91) v1(19.25,82.1) v1(19.25,78.29) v1(19.25,71.94) v1(19.25,68.13) v1(20.52,98.61) v1(20.52,97.34) v1(20.52,96.07) v1(20.52,94.8) v1(20.52,93.53) v1(20.52,92.26) v1(20.52,90.99) v1(20.52,89.72) v1(20.52,88.45) v1(20.52,87.18) v1(20.52,85.91) v1(20.52,80.83) v1(20.52,79.56) v1(20.52,78.29) v1(20.52,71.94) v1(20.52,69.4) v1(21.79,98.61) v1(21.79,97.34) v1(21.79,96.07) v1(21.79,94.8) v1(21.79,93.53) v1(21.79,92.26) v1(21.79,90.99) v1(21.79,89.72) v1(21.79,88.45) v1(21.79,87.18) v1(21.79,85.91) v1(21.79,80.83) v1(21.79,79.56) v1(21.79,78.29) v1(21.79,71.94) v1(21.79,69.4) v1(21.79,63.05) v1(23.06,98.61) v1(23.06,97.34) v1(23.06,96.07) v1(23.06,94.8) v1(23.06,93.53) v1(23.06,92.26) v1(23.06,90.99) v1(23.06,89.72) v1(23.06,88.45) v1(23.06,87.18) v1(23.06,85.91) v1(23.06,82.1) v1(23.06,80.83) v1(23.06,79.56) v1(23.06,78.29) v1(23.06,77.02) v1(23.06,75.75) v1(23.06,71.94) v1(23.06,70.67) v1(23.06,69.4) v1(23.06,68.13) v1(23.06,66.86) v1(23.06,63.05) v1(24.33,98.61) v1(24.33,97.34) v1(24.33,96.07) v1(24.33,94.8) v1(24.33,93.53) v1(24.33,92.26) v1(24.33,87.18) v1(24.33,85.91) v1(24.33,84.64) v1(24.33,83.37) v1(24.33,82.1) v1(24.33,80.83) v1(24.33,79.56) v1(24.33,78.29) v1(24.33,77.02) v1(24.33,75.75) v1(24.33,71.94) v1(24.33,70.67) v1(24.33,69.4) v1(24.33,68.13) v1(24.33,66.86) v1(24.33,65.59) v1(25.6,98.61) v1(25.6,97.34) v1(25.6,96.07) v1(25.6,94.8) v1(25.6,93.53) v1(25.6,92.26) v1(25.6,90.99) v1(25.6,89.72) v1(25.6,88.45) v1(25.6,87.18) v1(25.6,85.91) v1(25.6,84.64) v1(25.6,83.37) v1(25.6,82.1) v1(25.6,80.83) v1(25.6,79.56) v1(25.6,78.29) v1(25.6,77.02) v1(25.6,75.75) v1(25.6,69.4) v1(25.6,65.59) v1(25.6,64.32) v1(25.6,63.05) v1(26.87,97.34) v1(26.87,96.07) v1(26.87,94.8) v1(26.87,93.53) v1(26.87,92.26) v1(26.87,90.99) v1(26.87,89.72) v1(26.87,88.45) v1(26.87,87.18) v1(26.87,85.91) v1(26.87,84.64) v1(26.87,83.37) v1(26.87,82.1) v1(26.87,80.83) v1(26.87,79.56) v1(26.87,78.29) v1(26.87,77.02) v1(26.87,75.75) v1(26.87,74.48) v1(26.87,70.67)
VCC_OUT: length 46.9
  Top Layer w1.016: CN14.1 50.81,0.91
  Inner2 w0.254: 57.79,30.24 47.29,40.74 47.29,68.85
  vias: v1(157.13,12.58)
CLK: length 2.4
  Top Layer w0.254: U2.50 24.95,23.95 25.01,24.01 25.01,24.08 24.4,24.69 R65.1
DCBUS: length 27.1
  Top Layer w0.508: C24.1 44.29,31.07 43.57,31.78 U6.2
  Inner2 w2.032: 44.97,54.46 44.97,30.68
  vias: v1(9.08,59.64) v1(9.08,58.37) v1(9.08,57.1) v1(9.08,55.83) v1(10.35,59.64) v1(10.35,58.37) v1(10.35,57.1) v1(10.35,55.83) v1(10.99,49.5) v1(11.62,59.64) v1(11.62,58.37) v1(11.62,57.1) v1(11.62,55.83) v1(12.89,60.91) v1(12.89,59.64) v1(14.16,60.91) v1(14.16,59.64) v1(14.88,57.17) v1(14.88,55.9) v1(14.88,54.63) v1(14.88,53.36) v1(14.88,52.09) v1(15.43,60.91) v1(15.43,59.64) v1(16.15,57.17) v1(16.15,55.9) v1(16.15,54.63) v1(16.15,53.36) v1(16.15,52.09) v1(16.7,60.91) v1(16.7,59.64) v1(17.42,57.17) v1(17.42,55.9) v1(17.42,54.63) v1(17.42,53.36) v1(17.42,52.09) v1(17.97,60.91) v1(17.97,59.64) v1(18.69,57.17) v1(18.69,55.9) v1(18.69,54.63) v1(18.69,53.36) v1(18.69,52.09) v1(19.24,60.91) v1(19.24,59.64) v1(19.96,57.17) v1(19.96,55.9) v1(19.96,54.63) v1(19.96,53.36) v1(19.96,52.09) v1(20.51,60.91) v1(20.51,59.64) v1(21.78,60.91) v1(21.78,59.64) v1(21.98,52.02) v1(23.05,60.91) v1(23.05,59.64) v1(23.05,58.37) v1(23.05,57.1) v1(23.05,55.83) v1(23.05,54.56) v1(23.05,53.29) v1(23.25,52.02) v1(24.32,55.83) v1(24.32,54.56) v1(24.32,53.29) v1(24.52,52.02) v1(25.59,57.1) v1(25.59,55.83) v1(25.59,54.56) v1(25.59,53.29) v1(27.03,49.48) v1(27.06,52.02) v1(28.13,58.37) v1(28.13,57.1) v1(28.13,55.83) v1(28.13,54.56) v1(28.13,53.29) v1(28.33,52.02) v1(29.4,99.01) v1(29.4,97.74) v1(29.4,96.47) v1(29.4,95.2) v1(29.4,93.93) v1(29.4,92.66) v1(29.4,91.39) v1(29.4,90.12) v1(29.4,88.85) v1(29.4,87.58) v1(29.4,86.31) v1(29.4,85.04) v1(29.4,83.77) v1(29.4,82.5) v1(29.4,81.23) v1(29.4,79.96) v1(29.4,78.69) v1(29.4,77.42) v1(29.4,76.15) v1(29.4,74.88) v1(29.4,73.61) v1(29.4,59.64) v1(29.4,58.37) v1(29.4,57.1) v1(29.4,55.83) v1(29.4,54.56) v1(29.4,53.29) v1(30.67,99.01) v1(30.67,97.74) v1(30.67,96.47) v1(30.67,95.2) v1(30.67,93.93) v1(30.67,92.66) v1(30.67,91.39) v1(30.67,90.12) v1(30.67,88.85) v1(30.67,87.58) v1(30.67,86.31) v1(30.67,85.04) v1(30.67,83.77) v1(30.67,82.5) v1(30.67,81.23) v1(30.67,79.96) v1(30.67,78.69) v1(30.67,77.42) v1(30.67,76.15) v1(30.67,74.88) v1(30.67,73.61) v1(30.67,72.34) v1(30.67,71.07) v1(30.67,69.8) v1(30.67,68.53) v1(30.67,67.26) v1(30.67,65.99) v1(30.67,64.72) v1(30.67,63.45) v1(30.67,62.18) v1(30.67,60.91) v1(30.67,59.64) v1(30.67,58.37) v1(30.67,57.1) v1(30.67,55.83) v1(31.94,99.01) v1(31.94,97.74) v1(31.94,96.47) v1(31.94,95.2) v1(31.94,93.93) v1(31.94,92.66) v1(31.94,91.39) v1(31.94,90.12) v1(31.94,88.85) v1(31.94,87.58) v1(31.94,86.31) v1(31.94,85.04) v1(31.94,83.77) v1(31.94,82.5) v1(31.94,81.23) v1(31.94,79.96) v1(31.94,78.69) v1(31.94,77.42) v1(31.94,76.15) v1(31.94,74.88) v1(31.94,73.61) v1(31.94,72.34) v1(31.94,71.07) v1(31.94,69.8) v1(31.94,68.53) v1(31.94,67.26) v1(31.94,65.99) v1(31.94,64.72) v1(31.94,63.45) v1(31.94,62.18) v1(31.94,60.91) v1(31.94,59.64) v1(31.94,58.37) v1(31.94,57.1) v1(31.94,55.83) v1(33.21,99.01) v1(33.21,97.74) v1(33.21,96.47) v1(33.21,95.2) v1(33.21,93.93) v1(33.21,92.66) v1(33.21,91.39) v1(33.21,90.12) v1(33.21,88.85) v1(33.21,87.58) v1(33.21,86.31) v1(33.21,85.04) v1(33.21,83.77) v1(33.21,82.5) v1(33.21,81.23) v1(33.21,79.96) v1(33.21,78.69) v1(33.21,77.42) v1(33.21,76.15) v1(33.21,74.88) v1(33.21,73.61) v1(33.21,72.34) v1(33.21,71.07) v1(33.21,69.8) v1(33.21,68.53) v1(33.21,67.26) v1(33.21,65.99) v1(33.21,64.72) v1(33.21,63.45) v1(33.21,62.18) v1(33.21,60.91) v1(33.21,59.64) v1(33.21,58.37) v1(33.21,57.1) v1(33.21,55.83) v1(33.21,54.56) v1(33.21,53.29) v1(33.21,52.02) v1(34.48,99.01) v1(34.48,97.74) v1(34.48,96.47) v1(34.48,95.2) v1(34.48,93.93) v1(34.48,92.66) v1(34.48,91.39) v1(34.48,90.12) v1(34.48,88.85) v1(34.48,87.58) v1(34.48,86.31) v1(34.48,85.04) v1(34.48,83.77) v1(34.48,82.5) v1(34.48,81.23) v1(34.48,79.96) v1(34.48,78.69) v1(34.48,77.42) v1(34.48,76.15) v1(34.48,74.88) v1(34.48,73.61) v1(34.48,72.34) v1(34.48,71.07) v1(34.48,69.8) v1(34.48,68.53) v1(34.48,67.26) v1(34.48,65.99) v1(34.48,64.72) v1(34.48,63.45) v1(34.48,62.18) v1(34.48,60.91) v1(34.48,59.64) v1(34.48,58.37) v1(34.48,57.1) v1(34.48,55.83) v1(34.48,54.56) v1(34.48,53.29) v1(34.48,52.02) v1(35.75,99.01) v1(35.75,97.74) v1(35.75,96.47) v1(35.75,95.2) v1(35.75,93.93) v1(35.75,92.66) v1(35.75,91.39) v1(35.75,90.12) v1(35.75,88.85) v1(35.75,87.58) v1(35.75,86.31) v1(35.75,85.04) v1(35.75,83.77) v1(35.75,82.5) v1(35.75,81.23) v1(35.75,79.96) v1(35.75,78.69) v1(35.75,77.42) v1(35.75,76.15) v1(35.75,74.88) v1(35.75,73.61) v1(35.75,72.34) v1(35.75,71.07) v1(35.75,69.8) v1(35.75,68.53) v1(35.75,67.26) v1(35.75,65.99) v1(35.75,64.72) v1(35.75,63.45) v1(35.75,62.18) v1(35.75,60.91) v1(35.75,59.64) v1(35.75,58.37) v1(35.75,57.1) v1(35.75,55.83) v1(35.75,54.56) v1(35.75,53.29) v1(35.75,52.02) v1(48.06,32.77) v1(48.09,32.03) v1(48.85,32.77) v1(48.88,32.03) v1(151.71,13.29) v1(151.74,12.55)
DIANLIUKONGZHI: length 142.5
  Top Layer w0.254: 17.46,7.67 16.47,7.67 16.25,7.9 v1(16.25,8.84) ; C41.2 163.58,68.73 v1(163.58,66.93) 164.6,66.93 164.77,67.1 ; CN13.1 v1(231.1,56.32)
  Inner2 w0.254: 37.41,95.86 37.41,45.8 36.01,44.4 2.37,44.4 1.72,43.74 1.72,13.15 1.97,12.9 15.79,12.9 16.25,12.45 v1(16.25,8.84)
DIO: length 2.4
  Top Layer w0.254: R66.1 26,24.69 25.39,24.08 25.39,24.01 25.45,23.95 U2.49
FB: length 5.8
  Top Layer w0.508: 34.68,35.21 C25.2 ; 34.68,35.21 34.68,37.05 R16.1 ; 34.68,35.21 35.48,35.21 36.19,34.49 U6.5
KEY1: length 34.5
  Top Layer w0.254: K2.2 23.88,5.69 22.07,5.69 ; K2.2 K2.2 35.24,5.58 35.81,6.15 35.81,16.23 35.25,16.79 31.11,16.79 30.69,17.2 U2.41 ; K2.2 24,4.17 C61.1
NRST: length 24.9
  Top Layer w0.254: K1.2 19.03,5.46 18.88,5.61 ; K1.2 9.79,5.46 9.65,5.6 ; K1.2 11.25,5.35 11.25,3.98 ; 9.65,5.6 R31.2 ; 9.65,5.6 9.47,5.6 ; 14.55,5.6 14.55,17.22 15.03,17.7 U2.7
O_IN: length 6.9
  Top Layer w0.254: U2.5 12.16,18.7 X1.1 11.16,19.79 C34.1
O_OUT: length 5.1
  Top Layer w0.254: C35.1 12.81,16.04 X1.3 13.47,18.2 U2.6
PA: length 7.3
  Top Layer w0.508: R18.1 38.69,4.97 39.6,4.07 39.59,4.06 D13.1
PWM: length 55.2
  Top Layer w0.254: R35.2 33.07,19.29 v1(34.86,19.29)
  Top Layer w0.508: R40.1 v1(169.43,54.8)
  Inner4 w0.254: 39.36,67.59 39.36,46.53 39.11,46.28 35.48,46.28 34.77,45.57 34.77,19.38 v1(34.86,19.29)
R_EN: length 35.8
  Top Layer w0.254: U2.2 v1(18.11,20.2) ; v1(27.42,26.35) 42.87,26.35 43.26,26.74 43.26,29.24
  Inner2 w0.254: v1(27.42,26.35) 18.68,26.35 18.11,25.79 v1(18.11,20.2)
RGB: length 44.7
  Top Layer w0.254: U2.19 18.95,9.77 18.97,9.75 ; 2.6,37.85 v1(2.6,35.43)
  Inner4 w0.254: 2.81,35.43 17.17,35.43 18.98,33.62 v1(18.98,9.75)
RX_TX: length 6.5
  Top Layer w0.254: U2.33 28.65,13.2 31.66,10.19 R50.1
SHOOT: length 19.4
  Top Layer w0.254: R55.2 33.02,17.63 35.27,17.63 35.93,18.29 35.93,24.49 36.59,25.15 41.47,25.15 42.03,24.59 U8.5
SHUCHUDIANLIUJIANCE: length 68.1
  Top Layer w0.254: v1(34.09,12.55) 32.65,12.55 C58.2 30.5,14.7 U2.36 ; v1(160.79,52.59) 161.33,53.13 R63.1
  Inner4 w0.254: 40.1,66.55 40.1,45.95 39.62,45.47 36.21,45.47 35.36,44.62 35.36,12.92 34.97,12.52 34.12,12.52 v1(34.09,12.55)
SHURUDIANLIUJIANCE: length 96.7
  Top Layer w0.254: U2.37 30.93,15.2 C78.2 31.56,14.99 31.84,14.71 v1(33.05,14.71)
  Top Layer w0.508: v1(165.48,81.66) 165.48,81.65 R62.1
  Inner4 w0.254: v1(33.05,14.71) 32.11,15.65 32.11,46.31 33.43,47.64 37.38,47.64 38.13,48.39 38.13,97.64
STOP: length 86
  Top Layer w0.254: R54.2 33.12,11.43 v1(33.12,10.21) ; CN18.1 v1(231.1,65.86)
  Inner4 w0.254: 38.78,88.85 38.78,47.78 38.14,47.14 34.18,47.14 33.58,46.54 33.58,10.68 v1(33.12,10.21)
TX_RX: length 3.1
  Top Layer w0.254: R64.1 25.63,8.71 24.45,9.88 U2.30
WGND: length 9
  Top Layer w0.508: U8.3 43.3,4.18 43.41,4.07 45.59,4.07 D13.2
$1N490: length 10.2
  Top Layer w0.508: C7.1 28.82,66.03 Q11.3 28.79,63.92 28.79,61 26.75,58.96 26.75,58.96 26.75,56.92
$1N491: length 13.1
  Top Layer w0.508: 19.98,65.1 Q12.1 ; 19.98,65.1 23.05,65.1 24.57,63.58 24.57,59.14 24.75,58.96 ; 19.98,65.1 21.25,66.37 D8.2
$1N492: length 3.4
  Top Layer w0.635: Q11.1 27.23,65.3 27.23,66.22 C7.2 27.23,67.27 R9.1
$1N493: length 4.1
  Top Layer w0.635: R9.2 R8.1 28.61,70.74 29.09,71.22 U7.1
$1N496: length 6
  Top Layer w0.508: D7.1 4.27,54.67 4.89,55.3 4.89,56.86 6.6,56.86 6.6,58.55 6.71,58.67
$1N497: length 9.9
  Top Layer w0.762: 10.7,71.76 6.6,67.65 6.6,63.61 6.61,63.59
$1N498: length 3.1
  Top Layer w0.762: C9.1 8.91,54.64
$1N520: length 1.7
  Top Layer w0.508: L1.1 47.1,34.41
$1N560: length 2.5
  Top Layer w0.508: 33.94,31.22 34.5,31.78 U6.7
$1N561: length 3.7
  Top Layer w0.508: U6.3 42.22,33.02 43.54,33.02 R15.1
$1N567: length 2.4
  Top Layer w0.508: U6.4 42.62,34.75 42.62,36.5
$1N570: length 2.2
  Top Layer w0.508: L4.1 18.15,40.15 R25.2
$1N628: length 1.9
  Top Layer w0.254: 7.89,21.76 7.95,21.7 R14.1
$1N635: length 2
  Top Layer w0.254: C40.1 17.07,31.27 U5.1
$1N636: length 4.4
  Top Layer w0.254: U5.6 17.47,32.67 C40.2 14.07,32.67 L7.1
$1N647: length 2.2
  Top Layer w0.508: R26.2 8.22,32.83 L5.1
$1N701: length 1.7
  Top Layer w0.508: R45.2 41.27,28.87 L10.1
$1N731: length 34.1
  Top Layer w0.254: v1(8.2,11.91) 7.06,13.05 D4.2 6.89,13.17 5.5,13.17 CN9.5 ; R50.2 33.19,9.1 v1(33.19,7.07)
  Inner2 w0.254: v1(8.2,11.91) 8.56,11.55 8.74,11.55 14.22,6.07 32.89,6.07 33.19,6.38 v1(33.19,7.07)
$1N732: length 24.5
  Top Layer w0.254: CN9.4 5.59,13.55 7.46,13.55 v1(8.62,12.39) ; v1(24.27,7.14) 25.72,7.14 R64.2
  Inner2 w0.254: v1(24.27,7.14) 24.27,6.63 24.09,6.45 14.38,6.45 8.98,11.85 8.98,12.03 v1(8.62,12.39)
$1N733: length 35.1
  Top Layer w0.254: CN9.3 5.53,15.7 8.64,15.7 v1(8.79,15.55) ; v1(24.83,25.65) 24.83,25.92 R65.2
  Inner2 w0.254: v1(24.83,25.65) 24.83,25.15 25.01,24.97 25.01,15.8 23.41,14.2 9.65,14.2 9.24,14.61 7.94,14.61 7.56,14.99 7.56,15.49 7.83,15.75 8.08,15.75 8.28,15.55 v1(8.79,15.55)
$1N734: length 37.1
  Top Layer w0.254: CN9.2 5.51,16.12 8.6,16.12 v1(8.81,16.34) ; v1(25.59,25.63) 25.59,25.95 R66.2
  Inner2 w0.254: v1(25.59,25.63) 25.59,25.13 25.39,24.92 25.39,15.64 23.57,13.82 9.5,13.82 9.08,14.23 7.78,14.23 7.18,14.83 7.18,15.72 7.59,16.13 8.1,16.13 8.3,16.34 v1(8.81,16.34)
$1N758: length 4.5
  Top Layer w0.254: U2.43 30.47,18.2 R35.1
$1N824: length 4.2
  Top Layer w0.254: U2.42 31.65,17.7
$1N834: length 4.8
  Top Layer w0.254: U5.3 22.08,30.41 22.34,30.16 22.34,28.97 22.11,28.75 21.48,28.75
$1N836: length 25
  Top Layer w0.254: C45.1 15.14,28.01 v1(15.14,26.67) 21.31,26.67 R36.1
  Top Layer w0.508: 12.34,34.63 12.31,34.6 v1(12.31,33.95)
  Inner4 w0.508: v1(15.14,25.91) v1(15.14,26.67) 9.73,26.67 9.43,26.96 9.43,32.99 9.83,33.39 12.29,33.39 v1(12.31,33.37) v1(12.31,33.95)
$1N839: length 3
  Top Layer w0.254: R38.2 22.05,33.64 21.52,33.11 U5.4
$1N846: length 4.6
  Top Layer w0.508: C25.1 33.64,33.51 C22.1 31.98,33.46 R13.1
$1N868: length 7.5
  Top Layer w0.254: R44.2 D11.2 ; CN9.6 6.48,11.53
$1N887: length 2.4
  Top Layer w0.254: R61.2 19.45,24.88 U2.61
$1N947: length 9.6
  Top Layer w0.254: C71.2 173.44,69.06 173.87,69.49 173.87,71.74 174.18,72.05 176.76,72.05 177.18,72.47 177.18,73.19 ; U1.3 172.93,68.96
$1N960: length 1.4
  Top Layer w0.254: CN17.1 v1(231.1,61.1)
$1N961: length 1.7
  Top Layer w0.254: CN12.1 v1(231.1,51.56) ; 161.61,55.88 R63.2
$1N963: length 14.5
  Top Layer w0.254: D9.2 175.47,64.38 173.58,66.27 U1.2 173.58,67.73 174.76,68.91 177.38,68.91 178.07,68.22 179.26,68.22 ; C75.1 C85.1
$1N965: length 6.3
  Top Layer w0.254: 166.42,66.94 v1(166.42,69.16) ; R56.1 169.91,51.93 169.58,52.26 v1(169.58,52.72)
  Top Layer w0.508: v1(161.73,81.39) R57.2 161.68,80.16 C54.2
$1N967: length 3.6
  Top Layer w0.254: CN16.1 v1(231.15,70.63) ; U1.5 171.63,68.87 C2.1
$1N969: length 1.9
  Top Layer w0.508: 165.69,61.41 165.68,61.42 164.47,61.42 163.99,61.9
$1N970: length 9.3
  Top Layer w0.254: 172.38,73.01 172.28,72.91 U1.4 ; 172.38,73.01 172.41,73.03 ; 172.38,73.01 172.36,73.01 ; 172.38,73.01 175.35,73.01 C52.2
$1N973: length 1.7
  Top Layer w0.508: R4.2 157.96,54.49 C42.1
$1N978: length 1.6
  Top Layer w0.508: R49.1 164.36,72.79
$1N983: length 2.7
  Top Layer w0.254: C77.2 170.24,72.5 169.73,73 169.73,73.55 R59.1
$1N984: length 42.6
  Inner2 w0.254: 57.95,30.62 47.67,40.9 47.67,69.01
$1N986: length 2.7
  Top Layer w0.254: C77.1 168.85,72.5 169.35,73 169.35,73.55 168.55,74.36
$1N988: length 2.1
  Top Layer w0.254: U1.1 175.19,65.96 175.92,65.96 R42.1
$1N989: length 2.6
  Top Layer w1.016: 259.91,74.48 259.9,74.48 259.9,71.9 259.91,71.88
$1N991: length 1.4
  Top Layer w0.508: 173.41,57.08 173.41,55.69 173.39,55.68
$1N1002: length 4
  Top Layer w0.508: R41.1 R40.2
$1N1004: length 5
  Top Layer w0.254: U2.34 29.34,13.7 R54.1
$1N1013: length 4.2
  Top Layer w0.254: R2.1 18.75,7.79 18.45,8.08 U2.18
$1N1014: length 2.1
  Top Layer w0.508: U8.1 40.76,8.85 R18.2

## Copper pours and planes (outline as drawn; the poured copper is in the pictures)
12V on Top Layer: 38.62,37.96 32.76,37.96 32.77,34.46 30.48,34.47 30.48,33.5 22.02,33.5 22.02,34.39 20.14,34.39 20.14,32.51 19.08,32.51 19.08,37.64 18.59,38.13 18.59,39.77 38.58,39.77 38.63,39.73 38.63,37.97
GND on Top Layer: -15.05,105.44 111.8,105.44 111.8,-5.28 -15.05,-5.28
GND on Bottom Layer: -13.65,108.36 120.29,108.36 120.29,-8.76 -13.65,-8.76
GND on Bottom Layer: 0.25,0 0.25,41.84 39.59,41.48 39.59,39.52 50.02,39.52 50.66,0
GND on Inner1: -21.75,110.54 133.82,110.54 133.82,-15.57 -21.75,-15.57
GND on Inner2: -11.16,108 122.85,108 122.85,-10.8 -11.16,-10.8
GND on Inner3: -13.65,108.36 120.29,108.36 120.29,-8.76 -13.65,-8.76
GND on Inner4: -3.01,101.37 102.81,101.37 102.81,-2.11 -3.01,-2.11
GND_BAT on Top Layer: 0,99.95 16.97,99.95 17.07,99.85 17.07,68.15 8.79,68.15 8.79,61.85 5.54,61.85 5.54,57.6 0,57.6
GND_BAT on Bottom Layer: 0,99.95 16.97,99.95 17.07,99.85 17.07,68.15 8.79,68.15 8.79,61.85 7.62,61.85 7.62,57.6 0,57.6
GND_BAT on Inner3: 0,99.95 16.97,99.95 17.07,99.85 17.07,68.15 8.79,68.15 8.79,61.85 7.62,61.85 7.62,57.6 0,57.6
VCC_BAT on Top Layer: 17.25,99.97 27.83,99.97 27.71,61.68 8.13,61.68 8.13,68.06 17.26,68.06
VCC_BAT on Bottom Layer: 17.25,99.97 27.83,99.97 27.71,61.68 8.13,61.68 8.13,68.06 17.26,68.06
VCC_BAT on Inner3: 17.25,99.97 27.83,99.97 27.71,61.68 8.13,61.68 8.13,68.06 17.26,68.06
VCC_OUT on Top Layer: 50.23,37.74 52.9,37.74 52.92,33.93 53.86,33.91 53.86,30.96 55.47,30.96 55.47,0.13 55.34,0 47.41,0 47.41,18.69 50.23,21.51
VCC_OUT on Bottom Layer: 50.08,32.92 55.31,32.92 55.49,32.74 55.49,0 47.37,0 47.37,18.83 50.08,21.54
VCC_OUT on Bottom Layer: 50.23,32.72 55.47,32.72 55.57,0 47.34,0.03 47.34,18.44 50.23,21.34
VCC_OUT on Inner3: 50.23,32.72 55.47,32.72 55.47,0.13 55.34,0 45.91,0 47.46,1.55 47.46,18.57 50.23,21.34
DCBUS on Top Layer: 7.7,61.72 22.86,61.72 22.97,61.6 22.97,56.24 23.26,55.96 26.28,55.96 27.67,57.34 27.67,99.54 28.33,100.2 42.82,100.2 42.82,60.49 39.84,60.49 39.85,57.74 43.27,57.74 43.27,47.85 7.71,47.85 7.71,53.92 11.73,53.92 11.73,55.45 7.71,55.45 7.7,55.46
DCBUS on Top Layer: 43.03,33.2 50.11,33.2 50.11,29.46 45.15,29.46 45.15,30.02 44.79,30.38 43.13,30.38 43.03,30.48
DCBUS on Bottom Layer: 42,55.72 47.74,55.72 47.74,47.9 42,47.9
DCBUS on Bottom Layer: 7.78,61.45 28.13,61.46 28.13,100.46 43.73,100.46 43.73,48.67 0.47,48.67 0.47,57.55 7.78,57.55
DCBUS on Inner2: 43.02,33.32 48.39,33.32 48.39,29.25 43.02,29.25
DCBUS on Inner3: 7.86,61.46 27.54,61.46 27.54,100.46 40.07,100.46 40.07,47.98 7.87,47.98
DCBUS on Inner3: 42,55.72 47.74,55.72 47.74,47.9 42,47.9
$1N562 on Top Layer: 23.8,28.6 23.8,32.75 29.72,32.75 29.72,30.14 33.86,30.14 33.86,30.86 35.94,30.86 35.94,28.58
$1N836 on Top Layer: 18.95,28.19 15.91,28.19 15.63,27.91 15.63,25.51 14.58,25.51 14.58,30.23 14.38,30.43 12.65,30.43 12.65,31.65 15.29,31.65 15.29,30.97 16.1,30.21 16.1,29.46 18.95,29.46
$1N947 on Top Layer: 43.86,61.61 43.86,68.71 47.32,68.71 47.34,63.86 61.4,63.92 61.4,62.58 75.84,62.58 75.84,52.4 61.31,52.4 59.33,50.42 59.33,42.04 48.12,42.04 48.12,61.23 47.75,61.61
$1N984 on Top Layer: 61.46,52.22 75.91,52.22 75.91,31.24 74.29,29.62 61.08,29.62 59.4,31.29 59.4,50.16
$1N990 on Top Layer: 63.75,70.67 85.83,70.67 85.83,44.55 77.04,44.55 77.04,62.74 62.83,62.74 62.83,64.34 64.81,64.34 65.02,64.55 65.02,65.73 64.72,66.04 63.9,66.04 63.75,66.19

Small or netless copper shapes (teardrops, artwork), in the pictures only: 331 on Top Layer, 23 on Inner2, 17 on Inner4

## Text on the board
Top Silkscreen Layer: VIN | DUBS | AVCC | VCC | 5V | 12V | GND | VCC OUT | FAULT# | IVINMON | CTRL1 | ISMON | VREF
